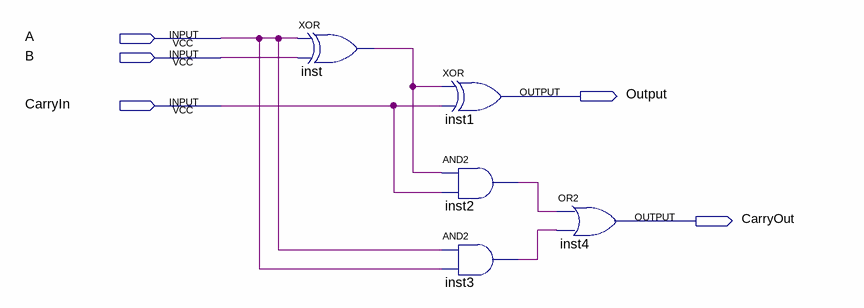
[diagram p0: schematic sheet]
// Quartus schematic full_adder.bdf as structural Verilog: 5 symbols, 5 pins
module full_adder (
  input  A,
  input  B,
  input  CarryIn,
  output Output,
  output CarryOut
);

  wire inst2_out, inst3_out, inst_out;

  xor inst (inst_out, A, B);
  xor inst1 (Output, inst_out, CarryIn);
  and inst2 (inst2_out, inst_out, CarryIn);
  and inst3 (inst3_out, A, A);
  or inst4 (CarryOut, inst2_out, inst3_out);
endmodule
